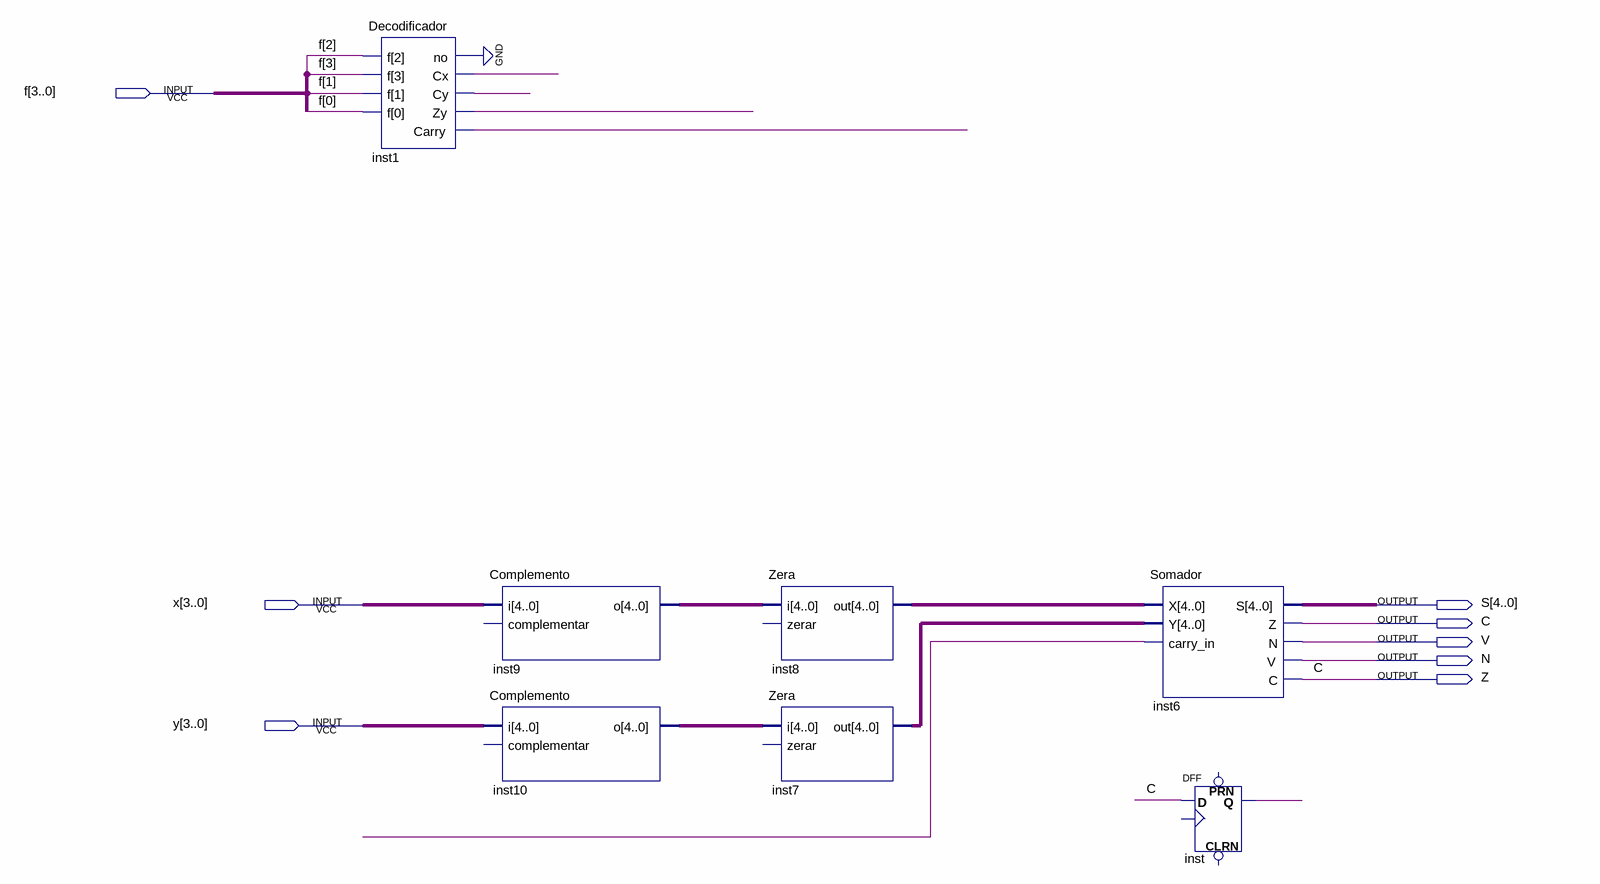
[diagram p0: schematic sheet]
// Quartus schematic ULA.bdf as structural Verilog: 7 symbols, 8 pins
module ULA (
  input  [3:0] f,
  input  [3:0] x,
  input  [3:0] y,
  output [4:0] S,
  output C,
  output V,
  output N,
  output Z
);

  wire inst1_carry, inst1_cx, inst1_cy, inst1_no, inst1_zy, inst_q, undriven;
  wire [4:0] inst7_out, inst8_out, inst9_o, inst10_o;

  Decodificador inst1 (.f(f), .no(inst1_no), .Cx(inst1_cx), .Cy(inst1_cy), .Zy(inst1_zy), .Carry(inst1_carry));
  Complemento inst9 (.i(x), .o(inst9_o));  // open: complementar
  Complemento inst10 (.i(y), .o(inst10_o));  // open: complementar
  Zera inst8 (.i(inst9_o), .out(inst8_out));  // open: zerar
  Zera inst7 (.i(inst10_o), .out(inst7_out));  // open: zerar
  Somador inst6 (.X(inst8_out), .Y(inst7_out), .carry_in(undriven), .S(S), .Z(C), .N(V), .V(N), .C(C));
  DFF inst (.D(C), .Q(inst_q));  // open: CLRN, CLK, PRN

  assign Z = C;
  // also tied to GND on the sheet: inst1_no
endmodule
